# Altium schematic sheet usb.SchDoc
size 420 x 297 mm; Address1: Address1; Address2: Address2; Address3: Address3; Address4: Address4; DocumentNumber: АБВГ.123456.001 Э3; SheetNumber: 3; SheetTotal: 3; Scale: 1:1; DocumentType: Схема электрическая принципиальная; FirstReferrence: АБВГ.123456.001
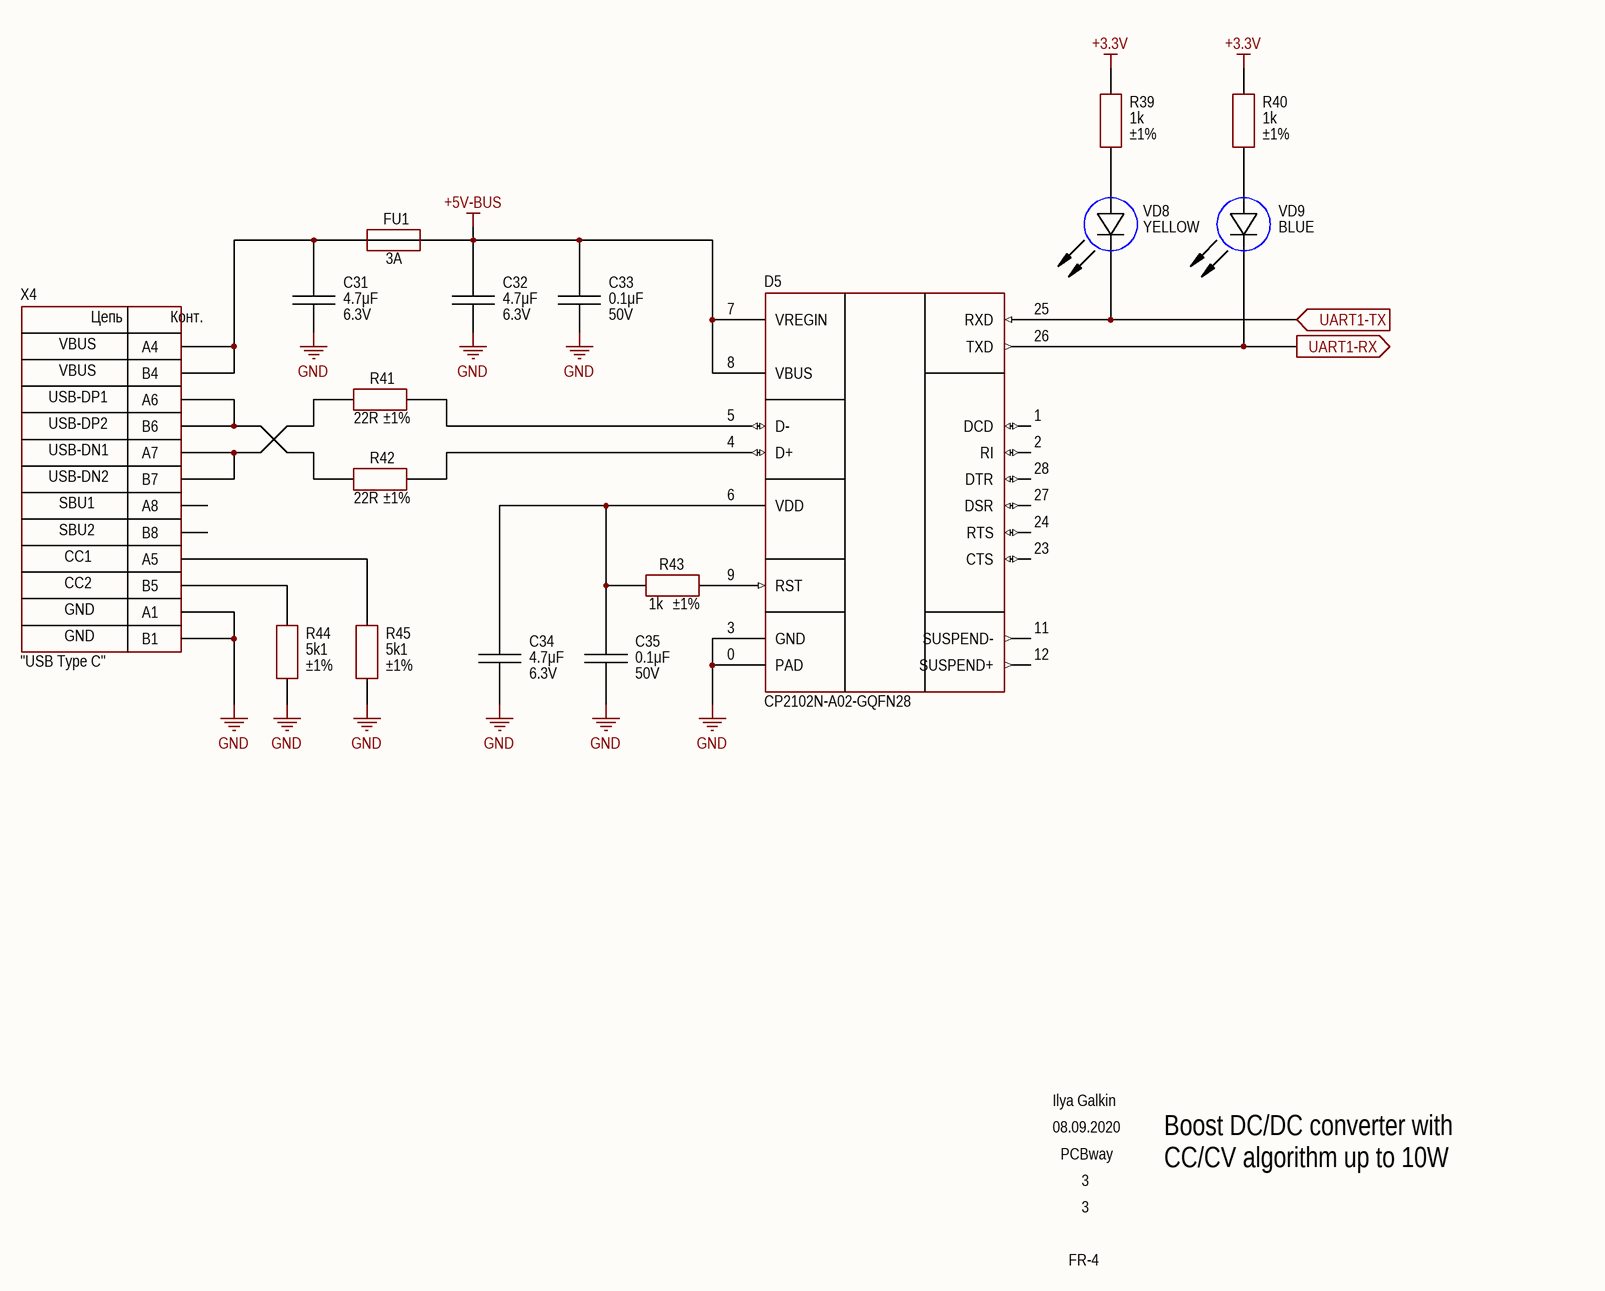
[diagram p0: usb.SchDoc]

## Parts
C31  value 4.7μF  Voltage: 6.3V  [CAP: 0603]
C32  value 4.7μF  Voltage: 6.3V  [CAP: 0603]
C33  value 0.1μF  Voltage: 50V  [CAP: 0603]
C34  value 4.7μF  Voltage: 6.3V  [CAP: 0603]
C35  value 0.1μF  Voltage: 50V  [CAP: 0603]
D5  PartNumber: CP2102N-A02-GQFN28  [28-QFN (5x5)]
FU1  MaxCurrent: 3A  [FUSE: 1206]
R39  value 1k  Tolerance: ±1%  [RES: 0603]
R40  value 1k  Tolerance: ±1%  [RES: 0603]
R41  value 22R  Tolerance: ±1%  [RES: 0603]
R42  value 22R  Tolerance: ±1%  [RES: 0603]
R43  value 1k  Tolerance: ±1%  [RES: 0603]
R44  value 5k1  Tolerance: ±1%  [RES: 0603]
R45  value 5k1  Tolerance: ±1%  [RES: 0603]
VD8  Color: YELLOW  [LED: 0603Y]
VD9  Color: BLUE  [LED: 0603B]
X4  CommentText: "USB Type C"  [CON: TYPE-C-31-M-12]

## Ports
UART1-RX (out), UART1-TX (in)

## Nets
+3.3V: R39.2 R40.2
+5V-BUS: C32.2 C33.2 D5.7(VREGIN) D5.8(VBUS) FU1.2
GND: C31.1 C32.1 C33.1 C34.1 C35.1 D5.0(PAD) D5.3(GND) R44.1 R45.1 X4.A1 X4.B1
UART1-RX: D5.26(TXD) VD9.2(C) ; port UART1-RX
UART1-TX: D5.25(RXD) VD8.2(C) ; port UART1-TX
NetC31_2: C31.2 FU1.1 X4.A4 X4.B4
NetC34_2: C34.2 C35.2 D5.6(VDD) R43.1
NetD5_4: D5.4(D+) R42.1
NetD5_5: D5.5(D-) R41.1
NetD5_9: D5.9(RST) R43.2
NetR39_1: R39.1 VD8.1(A)
NetR40_1: R40.1 VD9.1(A)
NetR41_2: R41.2 X4.A7 X4.B7
NetR42_2: R42.2 X4.A6 X4.B6
NetR44_2: R44.2 X4.B5
NetR45_2: R45.2 X4.A5

Not connected (* = marked no-connect by the designer): D5 1(DCD) 2(RI) 11(SUSPEND-) 12(SUSPEND+) 23(CTS) 24(RTS) 27(DSR) 28(DTR); X4 A8 B8

## Notes on the sheet
- Ilya Galkin
- 08.09.2020
- PCBway
- 3
- Boost DC/DC converter with
- CC/CV algorithm up to 10W
- FR-4
- Author
- Manufacturer
- Date
- Page
- Total pages
- Size page
- A3
- Materials
- (in symbol Connector_USB_Type_C) Цепь; Конт.; VBUS; USB-DP1; USB-DP2; USB-DN1; USB-DN2; SBU1; SBU2; CC1; CC2; GND

## Library data of the parts
C31 C32 C34 = Ceramic_0603: Manufacturer: Samsung; PartNumber: CL10B475KQ8NQNC; ValueManufacturerPartNumber: Ceramic capacitor, 4.7μF, X7R, ±10%, 6.3V, 0603, -55...+125°C; TypeCapacitor: Ceramic capacitor; Tolerance: ±10%; TypeDielectric: X7R; Package: 0603; HelpURL: https://www.digikey.com/product-detail/en/samsung-electro-mechanics/CL10B475KQ8NQNC/1276-2087-6-ND/3892601; Temperature: -55...+125°C
C33 C35 = Ceramic_0603: Manufacturer: Samsung; PartNumber: CL10B104KB8NNNL; ValueManufacturerPartNumber: Ceramic capacitor, 0.1μF, X7R, ±10%, 50V, 0603, -55...+125°C; TypeCapacitor: Ceramic capacitor; Tolerance: ±10%; TypeDielectric: X7R; Package: 0603; HelpURL: https://www.digikey.com/product-detail/en/samsung-electro-mechanics/CL10B104KB8NNNL/1276-CL10B104KB8NNNLCT-ND/10320686; Temperature: -55...+125°C
D5 = CP2102N: USB-to-UART; Manufacturer: Silicon Labs; ValueManufacturerPartNumber: IC usb-to-uart bridge, USB2.0, 3...3.6V, -40...+85°C, 28-VFQFN; Supply: 3...3.6V; HelpURL: https://www.digikey.com/product-detail/en/silicon-labs/CP2102N-A02-GQFN28/336-5889-ND/9863477; Package: 28-VFQFN; ComponentType: IC usb-to-uart bridge; Temperature: -40...+85°C; Standard: USB2.0
FU1 = Fuse: Manufacturer: Panasonic; PartNumber: ERB-RG3R00V; TypeFuse: Electromechanics relay; VoltageMax: 32VDC; Package: 1206 case; HelpURL: https://www.digikey.com/product-detail/en/panasonic-electronic-components/ERB-RG3R00V/P16741CT-ND/4280098; ValueManufacturerPartNumber: =TypeFuse+', '+VoltageMax+', '+MaxCurrent+', '+Package+', '+Temperature
R39 R40 R43 = Resistor_0603: Manufacturer: Yageo; PartNumber: RC0603FR-071KL; ValueManufacturerPartNumber: Resistor film, 1k, ±1%, 0603, 0.1W, -55...+125°C; TypeResistor: Resistor film; Power: 0.1W; Package: 0603; HelpURL: https://www.digikey.com/product-detail/en/yageo/RC0603FR-071KL/311-1-00KHRCT-ND/729790; Temperature: -55...+125°C
R41 R42 = Resistor_0603: Manufacturer: Yageo; PartNumber: RC0603FR-0722RL; ValueManufacturerPartNumber: Resistor film, 22R, ±1%, 0603, 0.1W, -55...+125°C; TypeResistor: Resistor film; Power: 0.1W; Package: 0603; HelpURL: https://www.digikey.com/product-detail/en/yageo/RC0603FR-0722RL/311-22-0HRCT-ND/730002; Temperature: -55...+125°C
R44 R45 = Resistor_0603: Manufacturer: Yageo; PartNumber: RC0603FR-075K1L; ValueManufacturerPartNumber: Resistor film, 5k1, ±1%, 0603, 0.1W, -55...+125°C; TypeResistor: Resistor film; Power: 0.1W; Package: 0603; HelpURL: https://www.digikey.com/product-detail/en/yageo/RC0603FR-075K1L/311-5-10KHRCT-ND/730215; Temperature: -55...+125°C
VD8 = LED_single: Manufacturer: Wurth; ValueManufacturerPartNumber: LED, 20mA, 2V, 0603, -55...+150°C; PartNumber: 150060YS75000; TypeDiode: LED; Current: 20mA; VoltageDrop: 2V; Package: 0603; HelpURL: https://www.digikey.com/product-detail/en/wurth-electronics-inc/150060YS75000/732-4981-1-ND/4489907; Temperature: -55...+150°C
VD9 = LED_single: Manufacturer: Wurth; ValueManufacturerPartNumber: LED, 20mA, 3.2V, 0603, -55...+150°C; PartNumber: 150060BS75000; TypeDiode: LED; Current: 20mA; VoltageDrop: 3.2V; Package: 0603; HelpURL: https://www.digikey.com/product-detail/en/wurth-electronics-inc/150060BS75000/732-4966-1-ND/4489893; Temperature: -55...+150°C
X4 = Connector_USB_Type_C: Manufacturer: Korean Hroparts; ValueManufacturerPartNumber: USB Type C, 3A; PartNumber: TYPE-C-31-M-12; TypeConnector: USB Type C; CurrentMax: 3A; HelpURL: https://lcsc.com/product-detail/USB-Type-C_Korean-Hroparts-Elec-TYPE-C-31-M-12_C165948.html